# Altium schematic sheet W5500.SchDoc: Ethernet &
size 420 x 297 mm; Author: G.Kasprowicz; CompanyName: WUT ISE; DrawnBy: G.Kasprowicz; Organization: WUT ISE; Address1: PW ISE; Address2: Nowowiejska 15/19 00-665 Warsaw; Address3: gkasprow@gmail.com; DocumentNumber: 3; Revision: 1.0; SheetNumber: 3; SheetTotal: 5; ModifiedBy: -; CheckedDate: -; Title2: POE; DivGrp: WUT ISE; Designer: G.Kasprowicz; ModifiedDate: -; ProjectName: Sensor Box
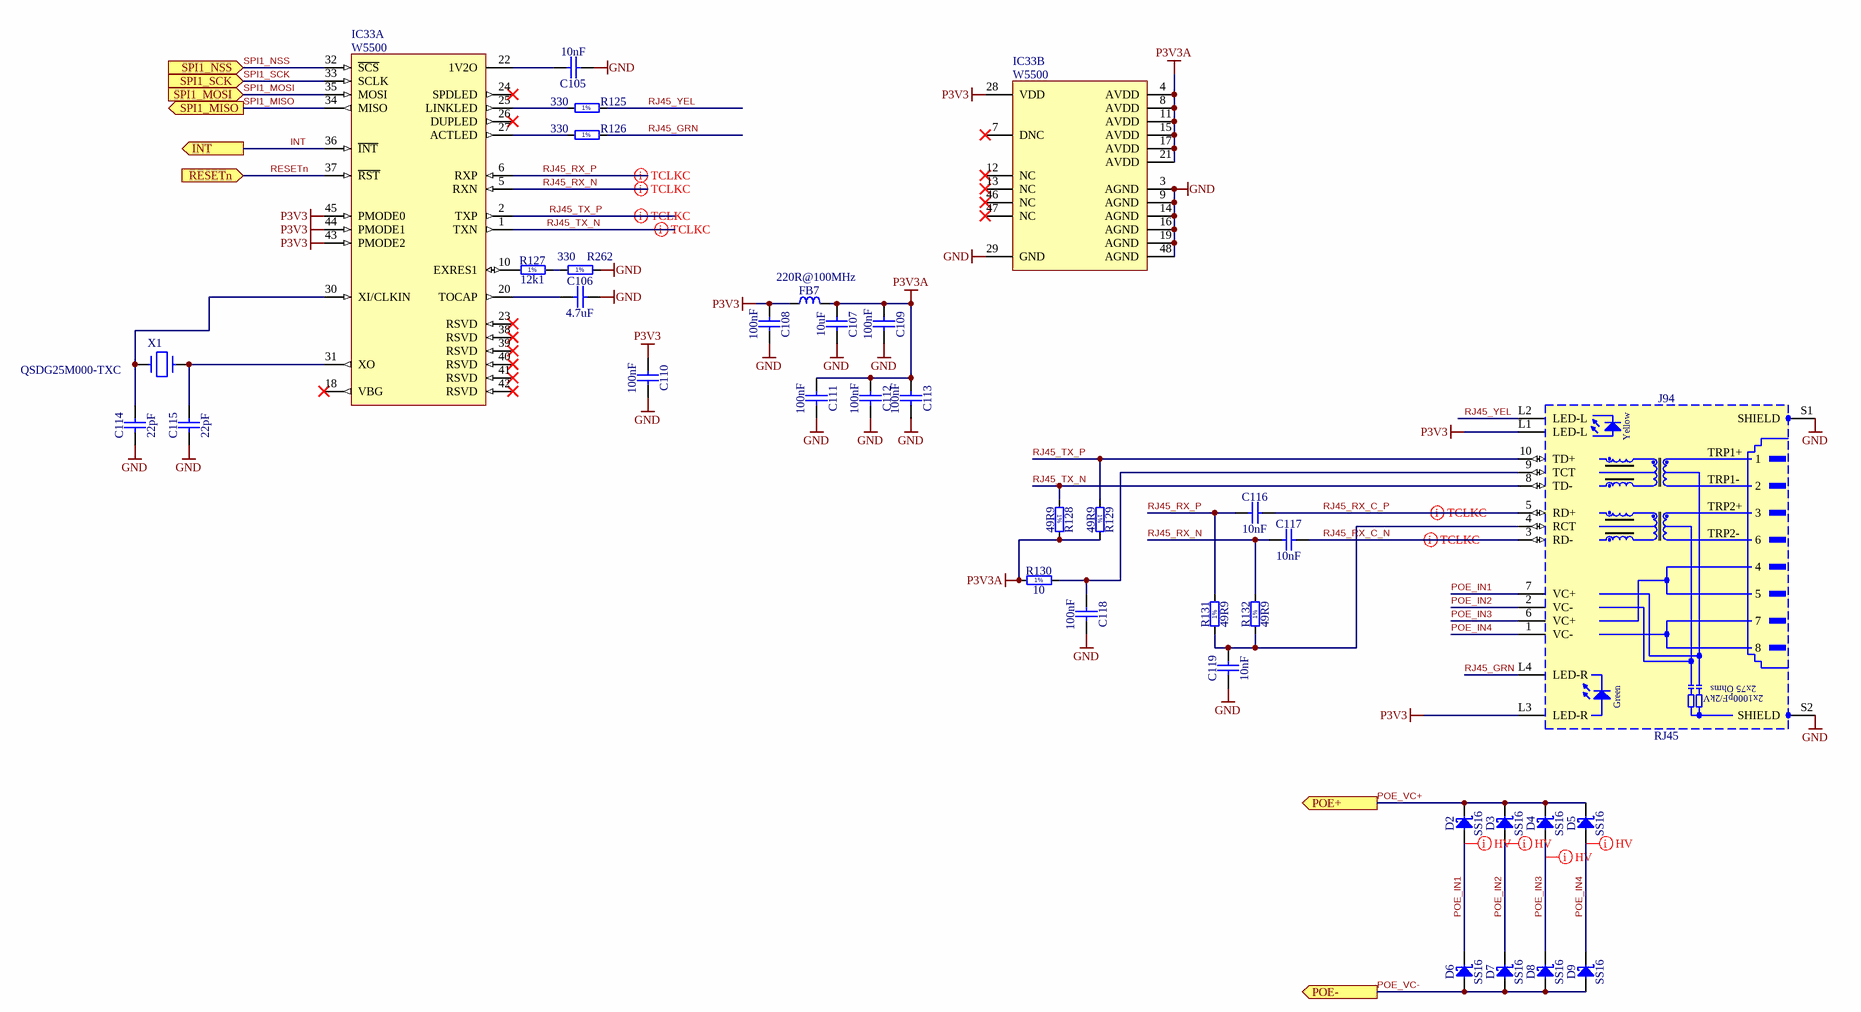
[diagram p0: W5500.SchDoc]

## Parts
C105  10nF  [CAPC1608X87N]
C106  4.7uF  [CAPC1608X90N]
C107  10uF  [CAPC2012X135N]
C108  100nF  [CAPC1005X55N]
C109  100nF  [CAPC1005X55N]
C110  100nF  [CAPC1005X55N]
C111  100nF  [CAPC1005X55N]
C112  100nF  [CAPC1005X55N]
C113  100nF  [CAPC1005X55N]
C114  22pF  [CAPC1005X55N]
C115  22pF  [CAPC1005X55N]
C116  10nF  [CAPC1608X87N]
C117  10nF  [CAPC1608X87N]
C118  100nF  [CAPC1005X55N]
C119  10nF  [CAPC1608X87N]
D2  SS16  [DIOM5127X229N]
D3  SS16  [DIOM5127X229N]
D4  SS16  [DIOM5127X229N]
D5  SS16  [DIOM5127X229N]
D6  SS16  [DIOM5127X229N]
D7  SS16  [DIOM5127X229N]
D8  SS16  [DIOM5127X229N]
D9  SS16  [DIOM5127X229N]
FB7  220R@100MHz  [INDC2012X105N]
IC33  W5500  [QFP50P900X900X160-48N]  (parts A,B of 2)
J94  RJ45  [ABRACON_ARJM11C7-114-BA-EW2]
R125  330  [RESC1005X40N]
R126  330  [RESC1005X40N]
R127  12k1  [RESC1005X40N]
R128  49R9  [RESC1005X40N]
R129  49R9  [RESC1005X40N]
R130  10  [RESC1005X40N]
R131  49R9  [RESC1005X40N]
R132  49R9  [RESC1005X40N]
R262  330  [RESC1005X40N]
X1  QSDG25M000-TXC  [XTAL_5.0*3.2]

## Ports
INT (out), POE+ (out), POE- (out), RESETn (in), SPI1_MISO (out), SPI1_MOSI (in), SPI1_NSS (in), SPI1_SCK (in)

## Nets
GND: C105.1 C106.2 C107.2 C108.2 C109.2 C110.2 C111.2 C112.2 C113.2 C114.1 C115.1 C118.2 C119.1 IC33.3(AGND) IC33.9(AGND) IC33.14(AGND) IC33.16(AGND) IC33.19(AGND) IC33.29(GND) IC33.48(AGND) J94.S1(SHIELD) J94.S2(SHIELD) R262.2
P3V3: C108.1 C110.1 FB7.1 IC33.28(VDD) IC33.43(PMODE2) IC33.44(PMODE1) IC33.45(PMODE0) J94.L1(LED-L) J94.L3(LED-R)
P3V3A: C107.1 C109.1 C111.1 C112.1 C113.1 FB7.2 IC33.4(AVDD) IC33.8(AVDD) IC33.11(AVDD) IC33.15(AVDD) IC33.17(AVDD) IC33.21(AVDD) R128.2 R129.2 R130.1
INT: IC33.36(~{INT}) ; port INT
POE_IN1: D2.2(A) D6.1(C) J94.7(VC+)
POE_IN2: D3.2(A) D7.1(C) J94.2(VC-)
POE_IN3: D4.2(A) D8.1(C) J94.6(VC+)
POE_IN4: D5.2(A) D9.1(C) J94.1(VC-)
POE_VC+: D2.1(C) D3.1(C) D4.1(C) D5.1(C) ; port POE+
POE_VC-: D6.2(A) D7.2(A) D8.2(A) D9.2(A) ; port POE-
RESETn: IC33.37(~{RST}) ; port RESETn
RJ45_GRN: J94.L4(LED-R) R126.2
RJ45_RX_C_N: C117.2 J94.3(RD-)
RJ45_RX_C_P: C116.2 J94.5(RD+)
RJ45_RX_N: C117.1 IC33.5(RXN) R132.2
RJ45_RX_P: C116.1 IC33.6(RXP) R131.2
RJ45_TX_N: IC33.1(TXN) J94.8(TD-) R128.1
RJ45_TX_P: IC33.2(TXP) J94.10(TD+) R129.1
RJ45_YEL: J94.L2(LED-L) R125.2
SPI1_MISO: IC33.34(MISO) ; port SPI1_MISO
SPI1_MOSI: IC33.35(MOSI) ; port SPI1_MOSI
SPI1_NSS: IC33.32(~{SCS}) ; port SPI1_NSS
SPI1_SCK: IC33.33(SCLK) ; port SPI1_SCK
NetC105_2: C105.2 IC33.22(1V2O)
NetC106_1: C106.1 IC33.20(TOCAP)
NetC114_2: C114.2 IC33.30(XI/CLKIN) X1.1
NetC115_2: C115.2 IC33.31(XO) X1.2
NetC118_1: C118.1 J94.9(TCT) R130.2
NetC119_2: C119.2 J94.4(RCT) R131.1 R132.1
NetIC33_10: IC33.10(EXRES1) R127.1
NetIC33_25: IC33.25(LINKLED) R125.1
NetIC33_27: IC33.27(ACTLED) R126.1
NetR127_2: R127.2 R262.1

Not connected (* = marked no-connect by the designer): IC33 7(DNC)* 12(NC)* 13(NC)* 18(VBG)* 23(RSVD)* 24(SPDLED)* 26(DUPLED)* 38(RSVD)* 39(RSVD)* 40(RSVD)* 41(RSVD)* 42(RSVD)* 46(NC)* 47(NC)*

## Layout directives
differential pair: RJ45_RX_C_N, RJ45_RX_C_P, RJ45_RX_N, RJ45_RX_P, RJ45_TX_N, RJ45_TX_P
net class HV: POE_IN1, POE_IN2, POE_IN3, POE_IN4

## Notes on the sheet
- Project/Equipment
- Document
- Designer
- Drawn by
- Check.by
- Copyright WUT ISE 2020.
  This documentation describes Open Hardware and is licensed under the CERN OHL v.1.2. You may redistribute and modify this documentation under the terms of the CERN OHL v.1.2. (http://ohwr.org/CERNOHL). This documentation is distributed WITHOUT ANY EXPRESS OR IMPLIED WARRANTY, INCLUDING OF MERCHANTABILITY, SATISFACTORY QUALITY AND FITNESS FOR A PARTICULAR PURPOSE. Please see the CERN OHL v.1.2 for applicable conditions.
- Contact
- File
- Last Mod.
- Print Date
- Sheet
- Size
- A3
- of
- Rev
- (in symbol CON_ETH_POE_ARJM11C7) Yellow; TRP1+; TRP1-; TRP2+; TRP2-; 2x75 Ohms; Green; 2x1000pF/2kV
- (in symbol R0402_10R_1%_0.0625W_200PPM) 1%
- (in symbol R0402_12K1_1%_0.0625W_100PPM) 1%
- (in symbol R0402_49R9_1%_0.0625W_100PPM) 1%
- (in symbol R0402_330R_1%_0.0625W_100PPM) 1%

## Library data of the parts
C105 C116 C117 C119 = CC0603_10NF_50V_5%_C0G: Non-polarised capacitor; Part Description: SMD Multilayer Chip Ceramic Capacitor; Manufacturer: GENERIC; Manufacturer1 Part Number: C1608C0G1H103J080AA; Voltage: 50V; TC: C0G/NP0; Tolerance: ±5%; Part Number: CC0603_10NF_50V_5%_C0G; Component Kind: Standard; Component Type: Standard; Pin Count: 2; Value: 10nF; Status: Preferred; Manufacturer Part Number: CC0603_10NF_50V_5%_C0G; Case: 0603; Mounted: Yes; Socket: No; SMD: Yes; Sense: No; Manufacturer1 Example: TDK; Manufacturer1 ComponentHeight: 0.9mm; HelpURL: \\cern.ch\dfs\Applications\Altium\Datasheets\CC0603_C0G_TDK_C.pdf; Author: CERN DEM JLC; CreateDate: 10.12.2014; LatestRevisionDate: 10.12.2014
C106 = CC0603_4.7UF_25V_10%_X5R: Non-polarised capacitor; Part Description: SMD Multilayer Chip Ceramic Capacitor; Manufacturer: GENERIC; Manufacturer1 Part Number: GRM188R61E475KE11D; Voltage: 25V; TC: X5R; Tolerance: ±10%; Part Number: CC0603_4.7UF_25V_10%_X5R; Component Kind: Standard; Component Type: Standard; Pin Count: 2; Value: 4.7uF; Status: None; Manufacturer Part Number: CC0603_4.7UF_25V_10%_X5R; Case: 0603; Mounted: Yes; Socket: No; SMD: Yes; Sense: No; Manufacturer1 Example: MURATA; Manufacturer1 ComponentHeight: 0.95mm; HelpURL: \\cern.ch\dfs\Applications\Altium\Datasheets\CC0603_MURATA_GRM188R61E475KE11D.pdf; Author: CERN DEM JLC; CreateDate: 10.11.2014; LatestRevisionDate: 10.11.2014
C107 = CC0805_10UF_16V_10%_X5R: Non-polarised capacitor; Part Description: SMD Multilayer Chip Ceramic Capacitor; Manufacturer: GENERIC; Manufacturer1 Part Number: C0805C106K4PAC; Voltage: 16V; TC: X5R; Tolerance: ±10%; Part Number: CC0805_10UF_16V_10%_X5R; Component Kind: Standard; Component Type: Standard; Pin Count: 2; Value: 10uF; Status: Preferred; Manufacturer Part Number: CC0805_10UF_16V_10%_X5R; Case: 0805; Mounted: Yes; Socket: No; SMD: Yes; Manufacturer1 Example: KEMET; Manufacturer1 ComponentHeight: 1.4mm; HelpURL: \\cern.ch\dfs\Applications\Altium\Datasheets\CC1206_X5R_KEMET.pdf; Author: CERN DEM JLC; CreateDate: 03.12.2007; LatestRevisionDate: 03.12.2007; Sense: No
C108-C113 C118 = CC0402_100NF_16V_10%_X7R: Non-polarised capacitor; Part Description: SMD Multilayer Chip Ceramic Capacitor; Manufacturer: GENERIC; Manufacturer1 Part Number: GRM155R71C104KA88D; Voltage: 16V; TC: X7R; Tolerance: ±10%; Part Number: CC0402_100NF_16V_10%_X7R; Component Kind: Standard; Component Type: Standard; Pin Count: 2; Value: 100nF; Status: Not Recommended; Manufacturer Part Number: CC0402_100NF_16V_10%_X7R; Case: 0402; Mounted: Yes; Socket: No; SMD: Yes; Manufacturer1 Example: MURATA; Manufacturer1 ComponentHeight: 0.55mm; HelpURL: \\cern.ch\dfs\Applications\Altium\Datasheets\CC0402_X7R_MURATA_GRM.pdf; Author: CERN DEM JLC; CreateDate: 05.12.2013; LatestRevisionDate: 03.12.2007; Sense: No
C114 C115 = CC0402_22PF_50V_5%_NP0: Non-polarised capacitor; Part Description: SMD Multilayer Chip Ceramic Capacitor; Manufacturer: GENERIC; Manufacturer1 Part Number: 223886915229; Voltage: 50V; TC: NP0; Tolerance: ±5%; Table: Capacitors SMD; Part Number: CC0402_22PF_50V_5%_NP0; Component Kind: Standard; Component Type: Standard; Pin Count: 2; Value: 22pF; Status: Not Recommended; Manufacturer Part Number: CC0402_22PF_50V_5%_NP0; Case: 0402; Mounted: Yes; Socket: No; SMD: Yes; Manufacturer1 Example: PHYCOMP; Manufacturer1 ComponentHeight: 0.55mm; HelpURL: \\cern.ch\dfs\Applications\Altium\Datasheets\CC0402_NP0_PHYCOMP.pdf; Author: CERN DEM JLC; CreateDate: 2007-12-03; LatestRevisionDate: 2007-12-03
D2-D9 = SS16: Schottky Diode; Part Description: Surface Mount Schottky Barrier Rectifier; Manufacturer: VISHAY GENERAL SEMICONDUCTOR; Voltage: 60V; Power: 1A; PressFit: No; Bonding: No; Part Number: SS16; Component Kind: Standard; Component Type: Standard; Device: SS16; PackageDescription: DO-214-AC Molded Diode, Body 5.1x2.7mm, IPC Medium Density; Manufacturer Part Number: SS16; Pin Count: 2; Case: DO-214AC; Mounted: Yes; Socket: No; SMD: Yes; Sense: No; ComponentHeight: 2.29mm; HelpURL: \\cern.ch\dfs\Applications\Altium\Datasheets\SS16.pdf; Author: CERN DEM JLC; CreateDate: 15.07.2008; LatestRevisionDate: 23.08.2010
FB7 = IND0805_MURATA_BLM21PG221SN1D: Inductor; Part Description: SMD EMIFIL Suppression Chip Ferrite Bead; Manufacturer: MURATA; Power: 2A; Resistance: 0.05R; Tolerance: ±25%; Table: Inductors SMD; Part Number: IND0805_MURATA_BLM21PG221SN1D; Component Kind: Standard; Component Type: Standard; Pin Count: 2; Value: 220R@100MHz; Status: None; Manufacturer Part Number: BLM21PG221SN1D; Case: 0805; Mounted: Yes; Socket: No; SMD: Yes; ComponentHeight: 1.05mm; HelpURL: \\cern.ch\dfs\Applications\Altium\Datasheets\IND0402_MURATA_BLM21P.pdf; Author: CERN DEM JLC; CreateDate: 2010-01-25; LatestRevisionDate: 2010-01-25
IC33 = W5500: iEthernet W5500 TCP/IP Performance and High Speed SPI Ethernet Controller; Manufacturer: WIZNET; PressFit: No; Bonding: No; Part Number: W5500; Component Kind: Standard; Component Type: Standard; Device: W5500; PackageDescription: QFP, 0.50mm Pitch, Square, 48 Pin, 7.00mm L X 7.00mm W X 1.60mm H Body, IPC Medium Density; Part Description: iEthernet W5500 TCP/IP Performance and High Speed SPI Ethernet Controller; Manufacturer Part Number: W5500; Pin Count: 48; Case: QFP48; Mounted: Yes; Socket: No; SMD: Yes; Sense: No; ComponentHeight: 1.6mm; Author: CERN DEM MR; HelpURL: \\cern.ch\dfs\Applications\Altium\Datasheets\W5500.pdf; CreateDate: 15.02.2018; LatestRevisionDate: 15.02.2018
J94 = CON_ETH_POE_ARJM11C7: MagJack 10/100BaseT, PoE+, 1X1, OG/Y, -40 to 85*C, Tab Up, RoHS; Part Number: ARJM11C7-114-BA-EW2; Part Description: 1 Port, Orange Green/Yellow LEDs, RJ45 10/100BaseT, PoE, Ethernet MagJack® Connector Module; Manufacturer: Abracon; PressFit: No; Component Kind: Standard; Component Type: Standard; Pin Count: 18; Family: RJ45; Mounted: Yes; Socket: No; SMD: No; Sense: No; Status: None; Manufacturer Part Number: ARJM11C7-114-BA-EW2; ComponentHeight: 13.61mm; HelpURL: \\cern.ch\dfs\Applications\Altium\Datasheets\BELFUSE_0826-1X1T-GJ-F.pdf; Author: GK; CreateDate: 05.11.2012; LatestRevisionDate: 05.11.2012
R125 R126 R262 = R0402_330R_1%_0.0625W_100PPM: Resistor - 1%; Part Description: General Purpose Thick Film Chip Resistor; Manufacturer: GENERIC; Manufacturer1 Part Number: 232270673301L; TC: ±100ppm/°C; PressFit: No; Part Number: R0402_330R_1%_0.0625W_100PPM; Component Kind: Standard; Component Type: Standard; Pin Count: 2; Value: 330; Status: Not Recommended; Power: 0.0625W; Tolerance: ±1%; Manufacturer Part Number: R0402_330R_1%_0.0625W_100PPM; Case: 0402; Mounted: Yes; Sense: No; Socket: No; SMD: Yes; Manufacturer1 Example: YAGEO PHYCOMP; Manufacturer1 ComponentHeight: 0.4mm; HelpURL: \\cern.ch\dfs\Applications\Altium\Datasheets\R0402_Phycomp_RC0402.pdf; Author: CERN DEM JLC; CreateDate: 03.12.2007; LatestRevisionDate: 17.10.2012
R127 = R0402_12K1_1%_0.0625W_100PPM: Resistor - 1%; Part Description: General Purpose Thick Film Chip Resistor; Manufacturer: GENERIC; Manufacturer1 Part Number: 232270671213L or RC0402FR-0712K1L; TC: ±100ppm/°C; PressFit: No; Part Number: R0402_12K1_1%_0.0625W_100PPM; Component Kind: Standard; Component Type: Standard; Pin Count: 2; Value: 12k1; Status: Not Recommended; Power: 0.0625W; Tolerance: ±1%; Manufacturer Part Number: R0402_12K1_1%_0.0625W_100PPM; Case: 0402; Mounted: Yes; Sense: No; Socket: No; SMD: Yes; Manufacturer1 Example: YAGEO PHYCOMP; Manufacturer1 ComponentHeight: 0.4mm; HelpURL: \\cern.ch\dfs\Applications\Altium\Datasheets\R0402_Phycomp_RC0402.pdf; Author: CERN DEM JLC; CreateDate: 24.10.2012; LatestRevisionDate: 24.10.2012
R128 R129 R131 R132 = R0402_49R9_1%_0.0625W_100PPM: Resistor - 1%; Part Description: General Purpose Thick Film Chip Resistor; Manufacturer: GENERIC; Manufacturer1 Part Number: 232270674999L or RC0402FR-0749R9L; TC: ±100ppm/°C; Table: Resistors SMD; Part Number: R0402_49R9_1%_0.0625W_100PPM; Component Kind: Standard; Component Type: Standard; Pin Count: 2; Value: 49R9; Status: Not recommended; Power: 0.0625W; Tolerance: ±1%; Manufacturer Part Number: R0402_49R9_1%_0.0625W_100PPM; Case: 0402; Mounted: Yes; Socket: No; SMD: Yes; Manufacturer1 Example: YAGEO PHYCOMP; Manufacturer1 ComponentHeight: 0.4mm; HelpURL: \\cern.ch\dfs\Applications\Altium\Datasheets\R0402_Phycomp_RC0402.pdf; Author: CERN DEM JLC; CreateDate: 2012-10-24; LatestRevisionDate: 2012-10-24
R130 = R0402_10R_1%_0.0625W_200PPM: Resistor - 1%; Part Description: General Purpose Thick Film Chip Resistor; Manufacturer: GENERIC; Manufacturer1 Part Number: 232270671009L; TC: ±200ppm/°C; Part Number: R0402_10R_1%_0.0625W_200PPM; Component Kind: Standard; Component Type: Standard; Pin Count: 2; Value: 10; Status: Not recommended; Power: 0.0625W; Tolerance: ±1%; Manufacturer Part Number: R0402_10R_1%_0.0625W_200PPM; Case: 0402; Mounted: Yes; Sense: No; Socket: No; SMD: Yes; Manufacturer1 Example: YAGEO PHYCOMP; Manufacturer1 ComponentHeight: 0.4mm; HelpURL: \\cern.ch\dfs\Applications\Altium\Datasheets\R0402_Phycomp_RC0402.pdf; Author: CERN DEM JLC; CreateDate: 24.06.2009; LatestRevisionDate: 17.10.2012
X1 = X_CRYSTAL_SMD_5.0*3.2: miniature crystal oscillator (Maritex)